# EAGLE design Smart_Plant (EAGLE 9.5.1)

## Sheet 1 of 2
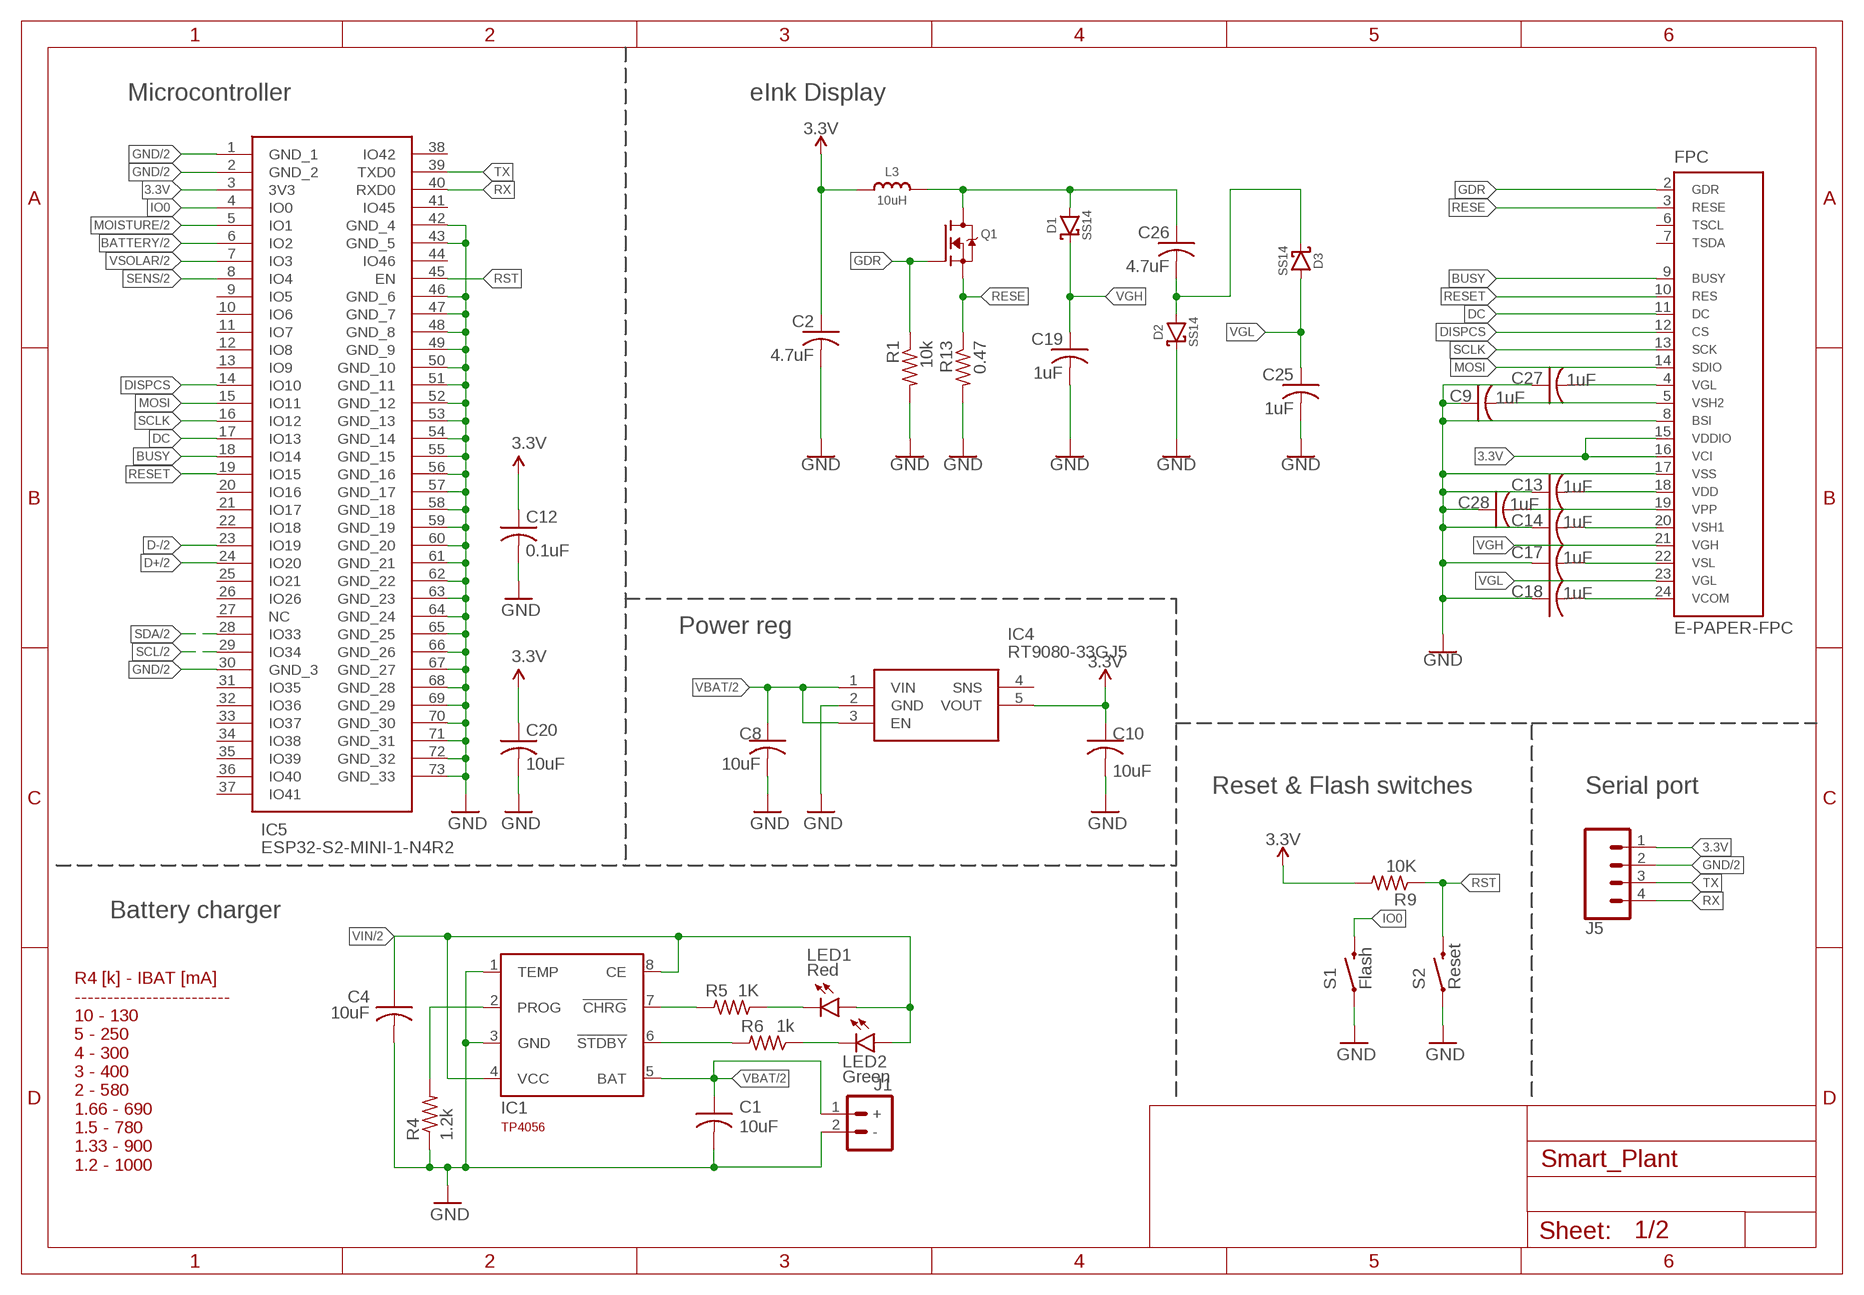
[diagram p0: schematic, sheet 1]

### Parts
C1  10uF  C-USC0603  [C0603]
C2  4.7uF  C-USC0603  [C0603]
C4  10uF  C-USC0603  [C0603]
C8  10uF  C-USC0603  [C0603]
C9  1uF  C-USC0603  [C0603]
C10  10uF  C-USC0603  [C0603]
C12  0.1uF  C-USC0603  [C0603]
C13  1uF  C-USC0603  [C0603]
C14  1uF  C-USC0603  [C0603]
C17  1uF  C-USC0603  [C0603]
C18  1uF  C-USC0603  [C0603]
C19  1uF  C-USC0603  [C0603]
C20  10uF  C-USC0603  [C0603]
C25  1uF  C-USC0603  [C0603]
C26  4.7uF  C-USC0603  [C0603]
C27  1uF  C-USC0603  [C0603]
C28  1uF  C-USC0603  [C0603]
D1  SS14  DIODE-SCHOTTKYSS14  [SMA-DIODE]
D2  SS14  DIODE-SCHOTTKYSS14  [SMA-DIODE]
D3  SS14  DIODE-SCHOTTKYSS14  [SMA-DIODE]
FPC  E-PAPER-FPC  [FPC_24_0.5MM]
IC1  TP4056  [SOT23-8]
IC4  RT9080-33GJ5  [SOT94P280X100-5N]
IC5  ESP32-S2-MINI-1-N4R2  [ESP32S2MINI1N4R2]
J1  BAT_CONN-JST-2MM-SMT  [JST-2-SMD]
J5  CONN_04PTH  [1X04]
L3  10uH  INDUCTORNR401  [INDUCTOR_4X4MM_NR401]
LED1  Red  LED0603  [LED_0603]
LED2  Green  LED0603  [LED_0603]
Q1  IRLML0100  IRLML2060TRPBF  [SOT23-3]
R1  10k  R-US_R0603  [R0603]
R4  1.2k  R-US_R0603  [R0603]
R5  1K  R-US_R0603  [R0603]
R6  1k  R-US_R0603  [R0603]
R9  10K  R-US_R0603  [R0603]
R13  0.47  R-US_R0603  [R0603]
S1  Flash  MOMENTARY-SWITCH-SPST-SMD-5.2MM-TALL  [TACTILE_SWITCH_SMD_5.2MM]
S2  Reset  MOMENTARY-SWITCH-SPST-SMD-5.2MM-TALL  [TACTILE_SWITCH_SMD_5.2MM]

### Nets
3.3V: C2.1 C10.1 C12.1 C20.1 FPC.15 FPC.16 IC4.5(VOUT) IC5.3(3V3) J5.1 L3.P$2 R9.2 ; also sheet 2
BATTERY: IC5.6(IO2) ; also sheet 2
BUSY: FPC.9 IC5.18(IO14)
D+: IC5.24(IO20) ; also sheet 2
D-: IC5.23(IO19) ; also sheet 2
DC: FPC.11 IC5.17(IO13)
DISPCS: FPC.12 IC5.14(IO10)
GDR: FPC.2 Q1.1(G) R1.1
GND: C1.2 C2.2 C4.2 C8.2 C9.1 C10.2 C12.2 C13.1 C14.1 C17.1 C18.1 C19.2 C20.2 C25.2 C27.1 C28.1 D2.C FPC.8 FPC.17 IC1.1(TEMP) IC1.3(GND) IC4.2(GND) IC5.1(GND_1) IC5.2(GND_2) IC5.30(GND_3) IC5.42(GND_4) IC5.43(GND_5) IC5.46(GND_6) IC5.47(GND_7) IC5.48(GND_8) IC5.49(GND_9) IC5.50(GND_10) IC5.51(GND_11) IC5.52(GND_12) IC5.53(GND_13) IC5.54(GND_14) IC5.55(GND_15) IC5.56(GND_16) IC5.57(GND_17) IC5.58(GND_18) IC5.59(GND_19) IC5.60(GND_20) IC5.61(GND_21) IC5.62(GND_22) IC5.63(GND_23) IC5.64(GND_24) IC5.65(GND_25) IC5.66(GND_26) IC5.67(GND_27) IC5.68(GND_28) IC5.69(GND_29) IC5.70(GND_30) IC5.71(GND_31) IC5.72(GND_32) IC5.73(GND_33) J1.2(-) J5.2 R1.2 R4.1 R13.2 S1.1 S2.1 ; also sheet 2
IO0: IC5.4(IO0) S1.3
MOISTURE: IC5.5(IO1) ; also sheet 2
MOSI: FPC.14 IC5.15(IO11)
N$1: IC1.6(!STDBY) R6.2
N$2: LED1.C R5.1
N$3: LED2.C R6.1
N$4: IC1.2(PROG) R4.2
N$6: IC1.7(!CHRG) R5.2
N$11: C9.2 FPC.5
N$12: C13.2 FPC.18
N$13: C14.2 FPC.20
N$14: C17.2 FPC.22
N$15: C18.2 FPC.24
N$16: C26.2 D2.A D3.C
N$17: C26.1 D1.A L3.P$1 Q1.3(D)
N$31: C27.2 FPC.4
N$32: C28.2 FPC.19
RESE: FPC.3 Q1.2(S) R13.1
RESET: FPC.10 IC5.19(IO15)
RST: IC5.45(EN) R9.1 S2.3
RX: IC5.40(RXD0) J5.4
SCL: IC5.29(IO34) ; also sheet 2
SCLK: FPC.13 IC5.16(IO12)
SDA: IC5.28(IO33) ; also sheet 2
SENS: IC5.8(IO4) ; also sheet 2
TX: IC5.39(TXD0) J5.3
VBAT: C1.1 C8.1 IC1.5(BAT) IC4.1(VIN) IC4.3(EN) J1.1(+) ; also sheet 2
VGH: C19.1 D1.C FPC.21
VGL: C25.1 D3.A FPC.23
VIN: C4.1 IC1.4(VCC) IC1.8(CE) LED1.A LED2.A ; also sheet 2
VSOLAR: IC5.7(IO3) ; also sheet 2
Unconnected: FPC.6 FPC.7 IC4.4(SNS) IC5.9(IO5) IC5.10(IO6) IC5.11(IO7) IC5.12(IO8) IC5.13(IO9) IC5.20(IO16) IC5.21(IO17) IC5.22(IO18) IC5.25(IO21) IC5.26(IO26) IC5.27(NC) IC5.31(IO35) IC5.32(IO36) IC5.33(IO37) IC5.34(IO38) IC5.35(IO39) IC5.36(IO40) IC5.37(IO41) IC5.38(IO42) IC5.41(IO45) IC5.44(IO46)

### Notes on the sheet
- Microcontroller | eInk Display
- Power reg
- Reset & Flash switches | Serial port
- Battery charger
- R4 [k] - IBAT [mA]
  ------------------------
  10 - 130
  5 - 250
  4 - 300
  3 - 400
  2 - 580
  1.66 - 690
  1.5 - 780
  1.33 - 900
  1.2 - 1000

## Sheet 2 of 2
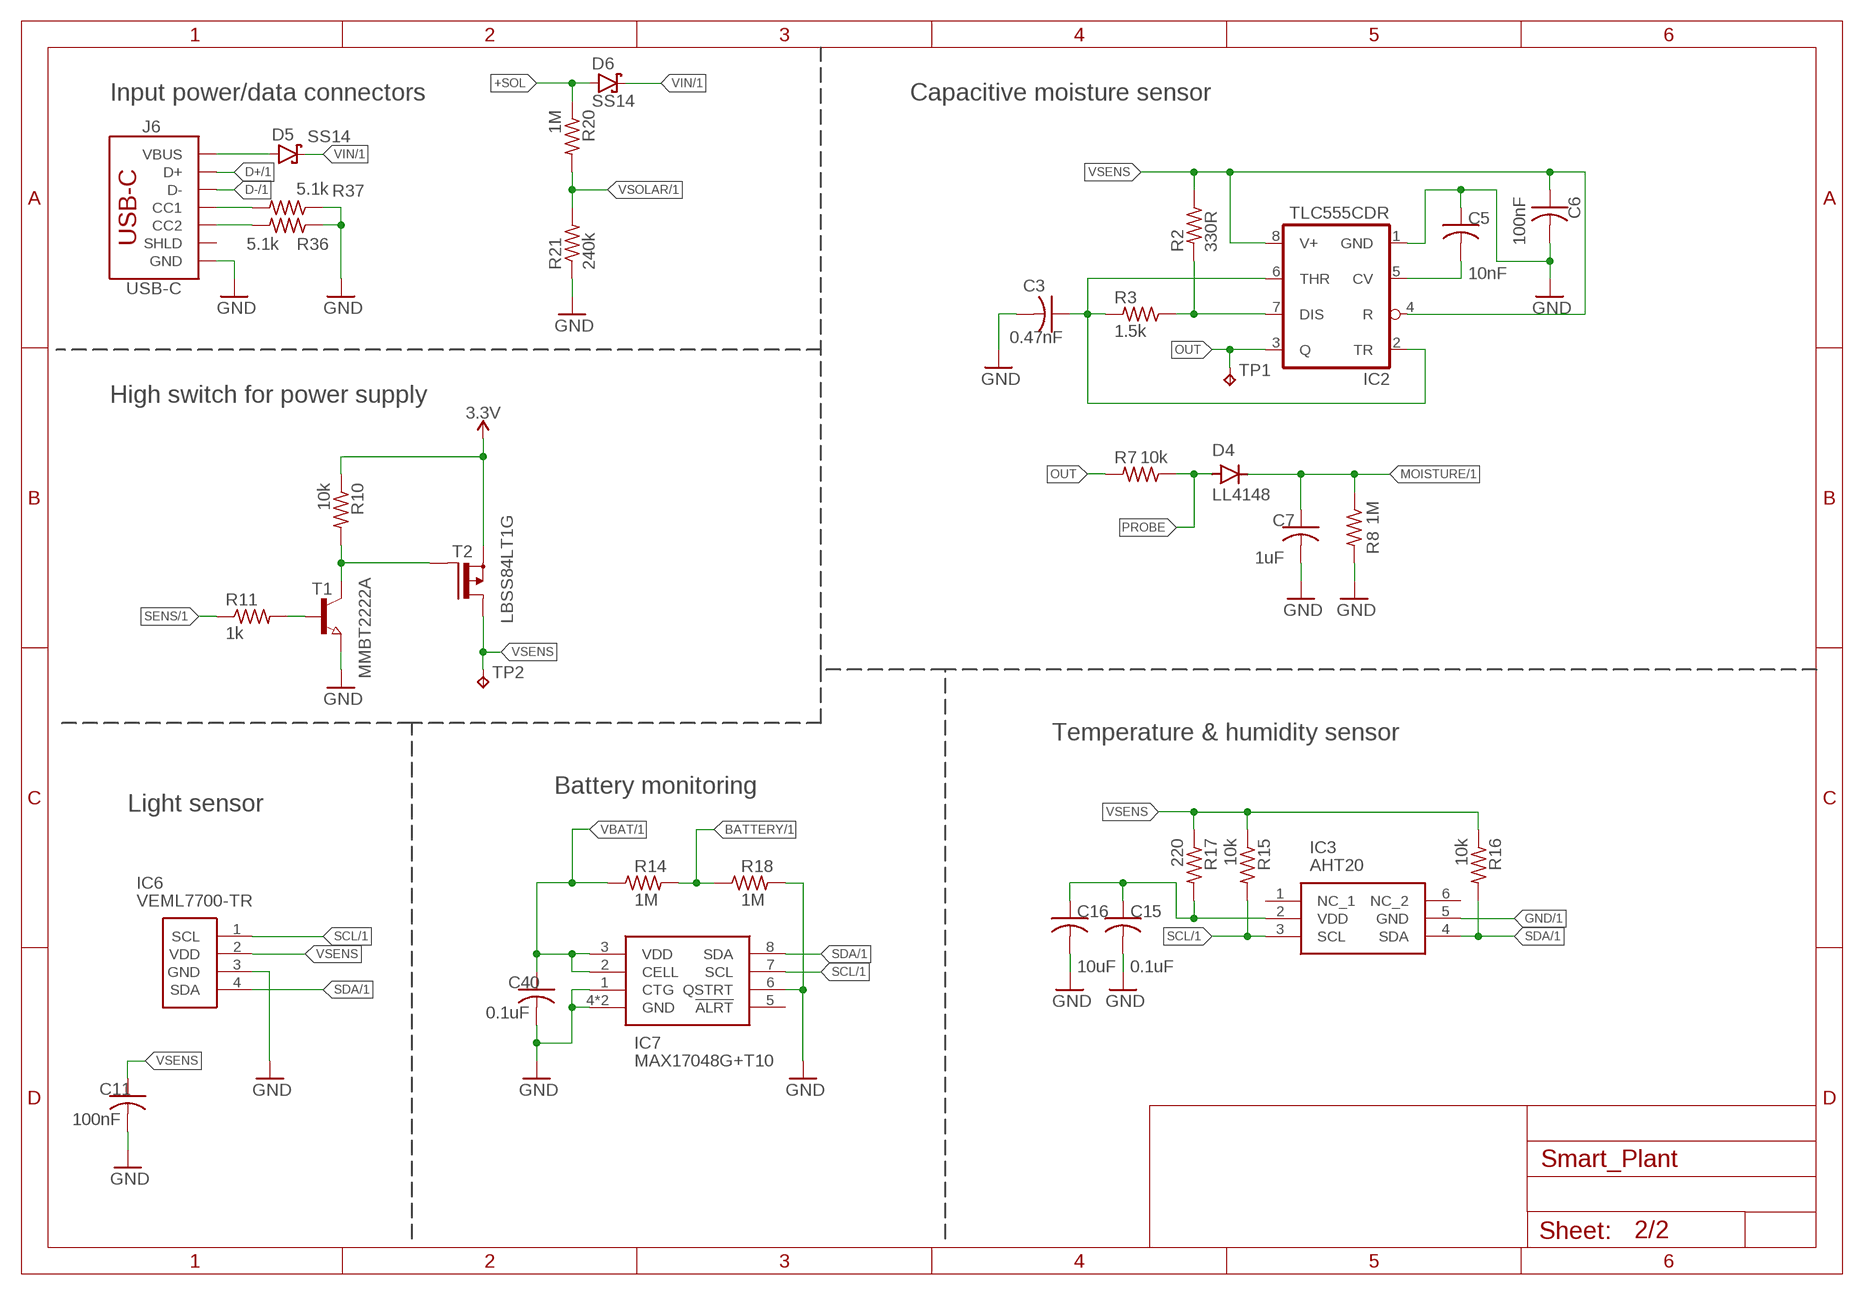
[diagram p1: schematic, sheet 2]

### Parts
C3  0.47nF  C-USC0603  [C0603]
C5  10nF  C-USC0603  [C0603]
C6  100nF  C-USC0603  [C0603]
C7  1uF  C-USC0603  [C0603]
C11  100nF  C-USC0603  [C0603]
C15  0.1uF  C-USC0603  [C0603]
C16  10uF  C-USC0603  [C0603]
C40  0.1uF  C-USC0603  [C0603]
D4  LL4148  [LL-34]
D5  SS14  DIODE-SCHOTTKYSS14  [SMA-DIODE]
D6  SS14  DIODE-SCHOTTKYSS14  [SMA-DIODE]
IC2  TLC555CDR  NE555D  [SO08]
IC3  AHT20  [AHT20]
IC6  VEML7700-TR  LIGHT_SENSOR-TR  [VEML7700-TR]
IC7  MAX17048G+T10  [SON50P200X200X80-9N]
J6  USB-C  USB_C_4-LAYER-ISOLATED  [USB-C-16P-4LAYER-ISOLATED]
R2  330R  R-US_R0603  [R0603]
R3  1.5k  R-US_R0603  [R0603]
R7  10k  R-US_R0603  [R0603]
R8  1M  R-US_R0603  [R0603]
R10  10k  R-US_R0603  [R0603]
R11  1k  R-US_R0603  [R0603]
R14  1M  R-US_R0603  [R0603]
R15  10k  R-US_R0603  [R0603]
R16  10k  R-US_R0603  [R0603]
R17  220  R-US_R0603  [R0603]
R18  1M  R-US_R0603  [R0603]
R20  1M  R-US_R0603  [R0603]
R21  240k  R-US_R0603  [R0603]
R36  5.1k  R-US_R0603  [R0603]
R37  5.1k  R-US_R0603  [R0603]
T1  MMBT2222A  T_NPN_MMBT2222A-1P_CHANGJ_SOT23-BEC  [SOT23]
T2  LBSS84LT1G  T_P-MOSFET_LBSS84LT1G_LRC_SOT23-GSD  [SOT23]
TP1  TPB1,27  [B1,27]
TP2  TPB1,27  [B1,27]

### Nets
3.3V: R10.1 T2.2(S) ; also sheet 1
+SOL [power]: D6.A R20.1
BATTERY: R14.2 R18.1 ; also sheet 1
D+: J6.A6(D+) J6.B6(D+) ; also sheet 1
D-: J6.A7(D-) J6.B7(D-) ; also sheet 1
GND: C3.2 C5.1 C6.2 C7.2 C11.2 C15.2 C16.2 C40.2 IC2.1(GND) IC3.5(GND) IC6.3(GND) IC7.1(CTG) IC7.4(GND) IC7.6(QSTRT) IC7.9(GND) J6.GND J6.GND2(GND) R8.2 R18.2 R21.1 R36.1 R37.1 T1.2(E) ; also sheet 1
MOISTURE: C7.1 D4.C R8.1 ; also sheet 1
N$5: C3.1 IC2.2(TR) IC2.6(THR) R3.2
N$7: IC2.7(DIS) R2.2 R3.1
N$8: C5.2 IC2.5(CV)
N$9: R10.2 T1.3(C) T2.1(G)
N$10: C15.1 C16.1 IC3.2(VDD) R17.2
N$18: R11.2 T1.1(B)
N$35: J6.B5(CC2) R36.2
N$46: J6.A5(CC1) R37.2
OUT: IC2.3(Q) R7.2 TP1.TP
PROBE: D4.A R7.1
SCL: IC3.3(SCL) IC6.1(SCL) IC7.7(SCL) R15.2 ; also sheet 1
SDA: IC3.4(SDA) IC6.4(SDA) IC7.8(SDA) R16.2 ; also sheet 1
SENS: R11.1 ; also sheet 1
V_USB: D5.A J6.VBUS1(VBUS) J6.VBUS2(VBUS)
VBAT: C40.1 IC7.2(CELL) IC7.3(VDD) R14.1 ; also sheet 1
VIN: D5.C D6.C ; also sheet 1
VSENS: C6.1 C11.1 IC2.4(R) IC2.8(V+) IC6.2(VDD) R2.1 R15.1 R16.1 R17.1 T2.3(D) TP2.TP
VSOLAR: R20.2 R21.2 ; also sheet 1
Unconnected: IC3.1(NC_1) IC3.6(NC_2) IC7.5(!ALRT) J6.SHLD1(SHLD) J6.SHLD2(SHLD) J6.SHLD3(SHLD) J6.SHLD4(SHLD) J6.SHLD5(SHLD) J6.SHLD6(SHLD) J6.SHLD7(SHLD) J6.SHLD8(SHLD)

### Notes on the sheet
- Input power/data connectors | Capacitive moisture sensor
- High switch for power supply
- Temperature & humidity sensor
- Battery monitoring
- Light sensor

## Library data of the parts
C1-C20 C25-C28 C40 = rcl:C-US: CAPACITOR, American symbol; SPICEPREFIX: C
D1-D3 D5 D6 = SpaceDIY_semiconductors:DIODE-SCHOTTKY: Schottky diode A Schottky diode is a semiconductor diode which has a low forward voltage drop and a very fast switching action.; PROD_ID: DIO-08053; VALUE: 1A/40V/500mV
D4 = SpaceDIY_semiconductors:LL4148: Diode Ultra Fast 100V 0.2A 2SOD-80 Source: Datasheet <https://www.onsemi.com/pub/Collateral/LL4148-D.pdf>; ARROW_PART_NUMBER: LL4148; ARROW_PRICE-STOCK: https://www.arrow.com/en/products/ll4148/on-semiconductor?region=europe; DESCRIPTION: Diode Ultra Fast 100V 0.2A 2SOD-80; HEIGHT: 1mm; LCSC: C9808; MANUFACTURER_NAME: onsemi; MANUFACTURER_PART_NUMBER: LL4148; MOUSER_PART_NUMBER: 512-LL4148; MOUSER_PRICE-STOCK: https://www.mouser.co.uk/ProductDetail/ON-Semiconductor-Fairchild/LL4148?qs=z%2Fr5wmDnQfY5jXgsdLPkRg%3D%3D
FPC = SpaceDIY_connectors:E-PAPER-FPC; LCSC: C2856831
IC1 = TP4056:TP4056: TP4056 Data sheet <http://goo.gl/J7k8TF> Dave.Calaway Eagle Library <https://goo.gl/Muy1Tr>; LCSC: C16581
IC2 = linear:*555: TIMER
IC3 = SamacSys_Parts:AHT20: Adafruit AHT20 - Temperature & Humidity Sensor Breakout Board - STEMMA QT / Qwiic Source: Datasheet <https://cdn-learn.adafruit.com/assets/assets/000/091/676/original/AHT20-datasheet-2020-4-16.pdf?1591047915>; DESCRIPTION: Adafruit AHT20 - Temperature & Humidity Sensor Breakout Board - STEMMA QT / Qwiic; HEIGHT: 1.1mm; MANUFACTURER_NAME: Adafruit; MANUFACTURER_PART_NUMBER: AHT20
IC4 = SamacSys_Parts:RT9080-33GJ5: IC REG LIN 3.3V 600MA TSOT23-5 Source: Datasheet <https://www.richtek.com/assets/product_file/RT9080/DS9080-05.pdf>; DESCRIPTION: IC REG LIN 3.3V 600MA TSOT23-5; HEIGHT: 1mm; LCSC: C841192; MANUFACTURER_NAME: RICHTEK; MANUFACTURER_PART_NUMBER: RT9080-33GJ5
IC5 = SpaceDIY_modules:ESP32-S2-MINI-1-N4R2: WiFi Modules - 802.11 SMD module, ESP32-S2FN4R2 with 4 MB flash die and 2 MB PSRAM die inside, PCB antenna Source: Datasheet <https://cz.mouser.com/datasheet/2/891/esp32_s2_mini_1_esp32_s2_mini_1u_datasheet_en-1928084.pdf>; DESCRIPTION: WiFi Modules - 802.11 SMD module, ESP32-S2FN4R2 with 4 MB flash die and 2 MB PSRAM die inside, PCB antenna; HEIGHT: 2.55mm; MANUFACTURER_NAME: Espressif Systems; MANUFACTURER_PART_NUMBER: ESP32-S2-MINI-1-N4R2; MOUSER_PART_NUMBER: 356-ESP32S2MINI1N4R2; MOUSER_PRICE-STOCK: https://www.mouser.co.uk/ProductDetail/Espressif-Systems/ESP32-S2-MINI-1-N4R2?qs=iLbezkQI%252Bsgb61FCBnw%252B9A%3D%3D
IC6 = SpaceDIY_sensors:LIGHT_SENSOR: High Accuracy Ambient Light Sensor with I2C Interface Source: Datasheet <http://www.vishay.com/docs/84286/veml7700.pdf>
IC7 = SpaceDIY_IC:MAX17048G+T10: Battery Management Host-Side Modelgauge (1-Cell) Source: Datasheet <https://datasheets.maximintegrated.com/en/ds/MAX17048-MAX17049.pdf>; LCSC: C2682616
J1 = SpaceDIY_connectors:BAT_CONN: Multi connection point. Often used as Generic Header-pin footprint for 0.1 inch spaced/style header connections On any of the 0.1 inch spaced packages, you can populate with these: Break Away Headers - Straight <https://www.sparkfun.com/products/116> (PRT-00116) Break Away Male Headers - Right Angle <https://www.sparkfun.com/products/553> (PRT-00553) Female Headers <https://www.sparkfun.com/products/115> (PRT-00115) Break Away Headers - Machine Pin <https://www.sparkfun.com/products/117> (PRT-00117) Break Away Female Headers - Swiss Machine Pin <https://www.sparkfun.com/products/743> (PRT-00743) For SCREWTERMINALS and SPRING TERMINALS visit here: Screw Terimnals on SparkFun.com <https://www.sparkfun.com/search/results?term=Screw+Terminals> (5mm/3.5mm/2.54mm spacing) This device is also useful as a general connection point to wire up your design to another part of your project. Our various solder wires solder well into these plated through hole pads. Hook-Up Wire - Assortment (Stranded, 22 AWG) <https://www.sparkfun.com/products/11375> (PRT-11375) Hook-Up Wire - Assortment (Solid Core, 22 AWG) <https://www.sparkfun.com/products/11367> (PRT-11367) View the entire wire category on our website here <https://www.sparkfun.com/categories/141> Special notes: Molex polarized connector foot print use with: PRT-08233 with associated crimp pins and housings. 2.54_SCREWTERM for use with PRT-10571. 3.5mm Screw Terminal footprints for PRT-08084 5mm Screw Terminal footprints for use with PRT-08432; LCSC: C3029440
J5 = SparkFun-Connectors:CONN_04: Multi connection point. Often used as Generic Header-pin footprint for 0.1 inch spaced/style header connections On any of the 0.1 inch spaced packages, you can populate with these: Break Away Headers - Straight <https://www.sparkfun.com/products/116> (PRT-00116) Break Away Male Headers - Right Angle <https://www.sparkfun.com/products/553> (PRT-00553) Female Headers <https://www.sparkfun.com/products/115> (PRT-00115) Break Away Headers - Machine Pin <https://www.sparkfun.com/products/117> (PRT-00117) Break Away Female Headers - Swiss Machine Pin <https://www.sparkfun.com/products/743> (PRT-00743) For SCREWTERMINALS and SPRING TERMINALS visit here: Screw Terimnals on SparkFun.com <https://www.sparkfun.com/search/results?term=Screw+Terminals> (5mm/3.5mm/2.54mm spacing) This device is also useful as a general connection point to wire up your design to another part of your project. Our various solder wires solder well into these plated through hole pads. Hook-Up Wire - Assortment (Stranded, 22 AWG) <https://www.sparkfun.com/products/11375> (PRT-11375) Hook-Up Wire - Assortment (Solid Core, 22 AWG) <https://www.sparkfun.com/products/11367> (PRT-11367) View the entire wire category on our website here <https://www.sparkfun.com/categories/141> Special notes: Molex polarized connector foot print use with SKU : PRT-08231 with associated crimp pins and housings. 1MM SMD Version SKU: PRT-10208; PROD_ID: CONN-09696
J6 = SparkFun-Connectors:USB_C: USB Type C 16Pin Connector Super Speed pins not available on the 16-pin purely SMD connector so this part is best for USB 2.0 implementations. D1 and D2 are tied together enabling D+/- no matter which way the cable is plugged into the connector. The two channel configuration pins (CC1/2) are exposed. These are normally connected to ground via 5.1k resistors but can be reconfigured for high current/high power applications. **4-LAYER BOARD WARNING!!** If designing 4-layer board, make sure to select the variant _4-LAYER-ISOLATED. The linked footprint (USB-C-16-4LAYER-ISOLATED) includes some very necessary cutout polygons in the inner layers (2 and 15). This prevents the PTH mounting shield legs on the USB connector from electrically connecting any other polygons on the inner layers (usually VCC and GND).; LCSC: C2765186; PROD_ID: CONN-14122; VALUE: USB Female Type C Connector
L3 = microbuilder:INDUCTOR: Inductors 0603: 10nH Ceramic Inductor - microwire antenna/RF (Digikey: 712-1434-2-ND) 0805: 560nH Ceramic Inductor - RF (Digikey: 553-1047-1-ND) 270nH Ceramic Inductor - Q = 40@250MHz, +-5%, 1 Ohm DC Resistance (Digikey: 535-10506-2-ND) 1007 (2518 Metric) SMT: 10µH 10% 250mOhm 820mA 1007 Inductor (Digikey: 587-2189-1-ND) 22µH 10% 500mOhm 580mA 1007 Inductor (Digikey: 587-2190-1-ND) 47µH 10% 950mOhm 420mA 1007 Inductor (Digikey: 587-2191-1-ND) 47µH 5% 100mOhm 1A 1008 Inductor (Digikey: 732-1816-1-ND) 5.0x5.0mm (Taiyo Yuden NR5040 Series) 6.8µH 20% 2.3A 64mOhm Inductor (Digikey: 587-2374-2-ND) 5.0x5.0mm (TDK VLC5045 Series) 4.7µH 20% 3.3A 34mOhm Inductor (Digikey: 445-6526-1-ND) 6.8µH 20% 2.7A 46mOhm Inductor (Digikey: 445-6527-1-ND) 6.0x6.0mm (TDK VLC6045 Series) 4.7µH 20% 3.8A 27mOhm Inductor (Digikey: 445-6538-2-ND) 6.8µH 20% 3A 41mOhm Inductor (Digikey: 445-6540-1-ND) 6.2µH 30% 2.2A 45mOhm Inductor (Digikey: SRR5028-6R2YCT-ND) - Not TDK VLC6045 but footprint should match 6.0x6.0mm (TDK SLF6045 Series) 6.8uH 30% 2A 33mOhm Inductor (Digikey: 445-4572-1-ND, Mouser: 810-SLF645T6R8N2R0PF) 6.0x6.0mm (Sumida CDRH5D28 Series) 6.2uH 30% 1.8A 45mOhm Inductor (Digikey: 308-1542-1-ND) Taiyo Yuden NR3015T2R2M - 2.2uH 20% 1.5A (Digikey: 587-1648-2-ND, Mouser: 963-NR3015T2R2M) - Used with TI TPS62172 CoilCraft RFID Transponder Coil - MA5532-AE (For use with AS3935 Lightning Sensor) Taiyo Yuden NRH2412T2R2MNGH - 2.2uH 20% 1AA (Digikey: 587-3443-1-ND) - Used with TI LM3671 Vishay IHLP 1.0uH Molded Inductor - 24mOhm DCR, 5A, +/-20%, -55°C-125°C (Digikey: 541-1319-1-ND)
LED1 = SpaceDIY_semiconductors:LED: LED (Generic) Standard schematic elements and footprints for 5mm, 3mm, 0402, 0603 , 0805 and 1206 sized LEDs. Generic LEDs with no color specified.; LCSC: C2286
LED2 = SpaceDIY_semiconductors:LED: LED (Generic) Standard schematic elements and footprints for 5mm, 3mm, 0402, 0603 , 0805 and 1206 sized LEDs. Generic LEDs with no color specified.; LCSC: C72043
Q1 = Parts:IRLML2060TRPBF
R1-R11 R13-R18 R20 R21 R36 R37 = rcl:R-US_: RESISTOR, American symbol; SPICEPREFIX: R
S1 S2 = SpaceDIY_electromechanical:MOMENTARY-SWITCH-SPST: Momentary Switch (Pushbutton) - SPST Normally-open (NO) SPST momentary switches (buttons, pushbuttons). Variants PTH-12MM - 12mm square, through-hole Momentary Pushbutton Switch - 12mm Square <https://www.sparkfun.com/products/9190> (COM-09190) PTH-6.0MM, PTH-6.0MM-KIT - 6.0mm square, through-hole Mini Pushbutton Switch <https://www.sparkfun.com/products/97> (COM-00097) KIT package intended for soldering kit's - only one side of pads' copper is exposed. PTH-RIGHT-ANGLE-KIT - Right-angle, through-hole Right Angle Tactile Button <https://www.sparkfun.com/products/10791> - Used on SparkFun BigTime Watch Kit <https://www.sparkfun.com/products/11734> SMD-12MM - 12mm square, surface-mount Tactile Button - SMD (12mm) <https://www.sparkfun.com/products/12993> (COM-12993) Used on SparkFun PicoBoard <https://www.sparkfun.com/products/11888> SMD-4.5MM - 4.5mm Square Trackball Switch Used on SparkFun Blackberry Trackballer Breakout <https://www.sparkfun.com/products/13169> SMD-4.6MMX2.8MM - 4.60mm x 2.80mm, surface mount Used on SparkFun Pro Micro - RP2040 <https://www.sparkfun.com/products/17717> SMD-5.2MM, SMD-5.2-REDUNDANT - 5.2mm square, surface-mount Mini Pushbutton Switch - SMD <https://www.sparkfun.com/products/8720> (COM-08720) Used on Arduino Pro Mini <https://www.sparkfun.com/products/11114> REDUNDANT package connects both switch circuits together SMD-6.0X3.5MM - 6.0 x 3.5mm, surface mount Momentary Reset Switch SMD <https://www.sparkfun.com/products/8229> (COM-08229) SMD-6.2MM-TALL - 6.2mm square, surface mount Tactile Button - SMD (6mm) <https://www.sparkfun.com/products/12992> Used on SparkFun Digital Sandbox <https://www.sparkfun.com/products/12651> SMD-RIGHT-ANGLE - Right-angle, surface mount Used on SparkFun Block for Intel® Edison - Arduino <https://www.sparkfun.com/products/13036>; LCSC: C318884; PROD_ID: SWCH-14139
T1 = JLC PCB Basic Parts_loc:T_NPN_: Transistor NPN; LCSC_DATASHEET: https://datasheet.lcsc.com/lcsc/1811081957_Changjiang-Electronics-Tech--CJ-MMBT2222A-1P_C8512.pdf; LCSC_PART: C8512; LCSC_PRICE1_EUR: 0.023149606; LCSC_ROTATION_CCW: 180; PROPERTIES: 0.3W NPN 0.6A 40V SOT-23(SOT-23-3) Bipolar Transistors - BJT ROHS
T2 = JLC PCB Basic Parts_loc:T_P-MOSFET_: Transistor P-MOSFET; LCSC_DATASHEET: https://datasheet.lcsc.com/lcsc/1811031711_LRC-LBSS84LT1G_C8492.pdf; LCSC_PART: C8492; LCSC_PRICE1_EUR: 0.031496063; LCSC_ROTATION_CCW: 180; PROPERTIES: 2V 250uA 10Ohm 100mA,5V 0.13A 0.225W P Channel 50V SOT-23(SOT-23-3) MOSFETs ROHS
TP1 TP2 = testpad:TP: Test pad

## Net classes
1 power: width 0.254 mm

## Board
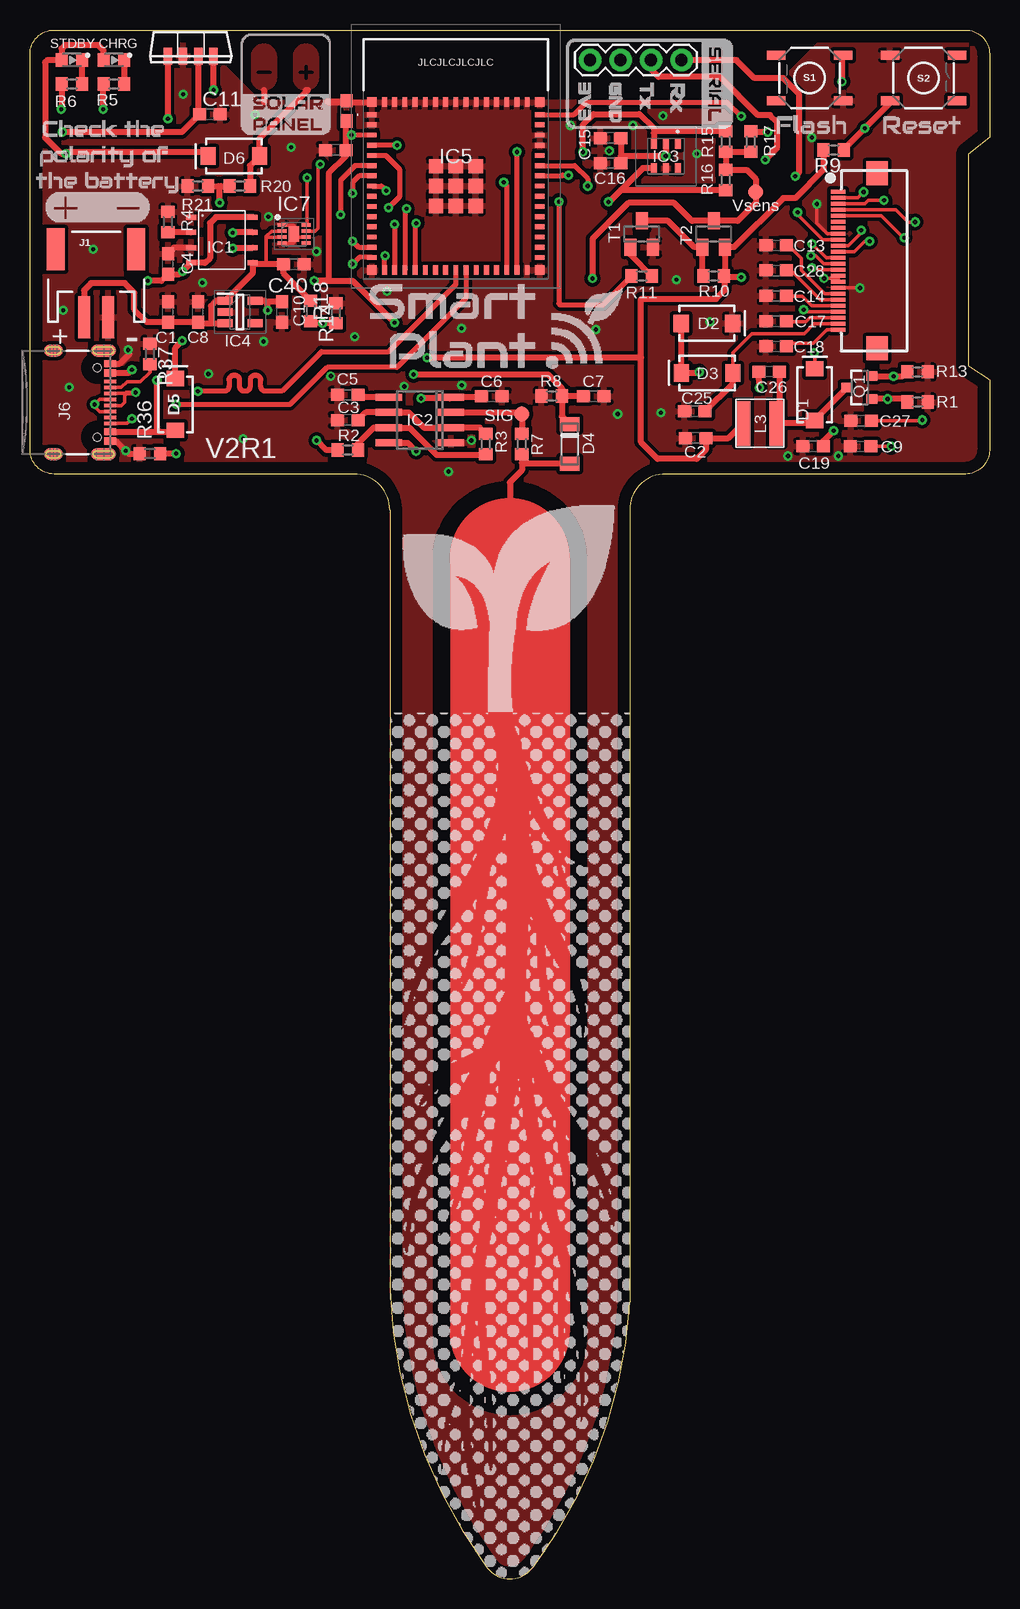
[diagram p2: board, top side]
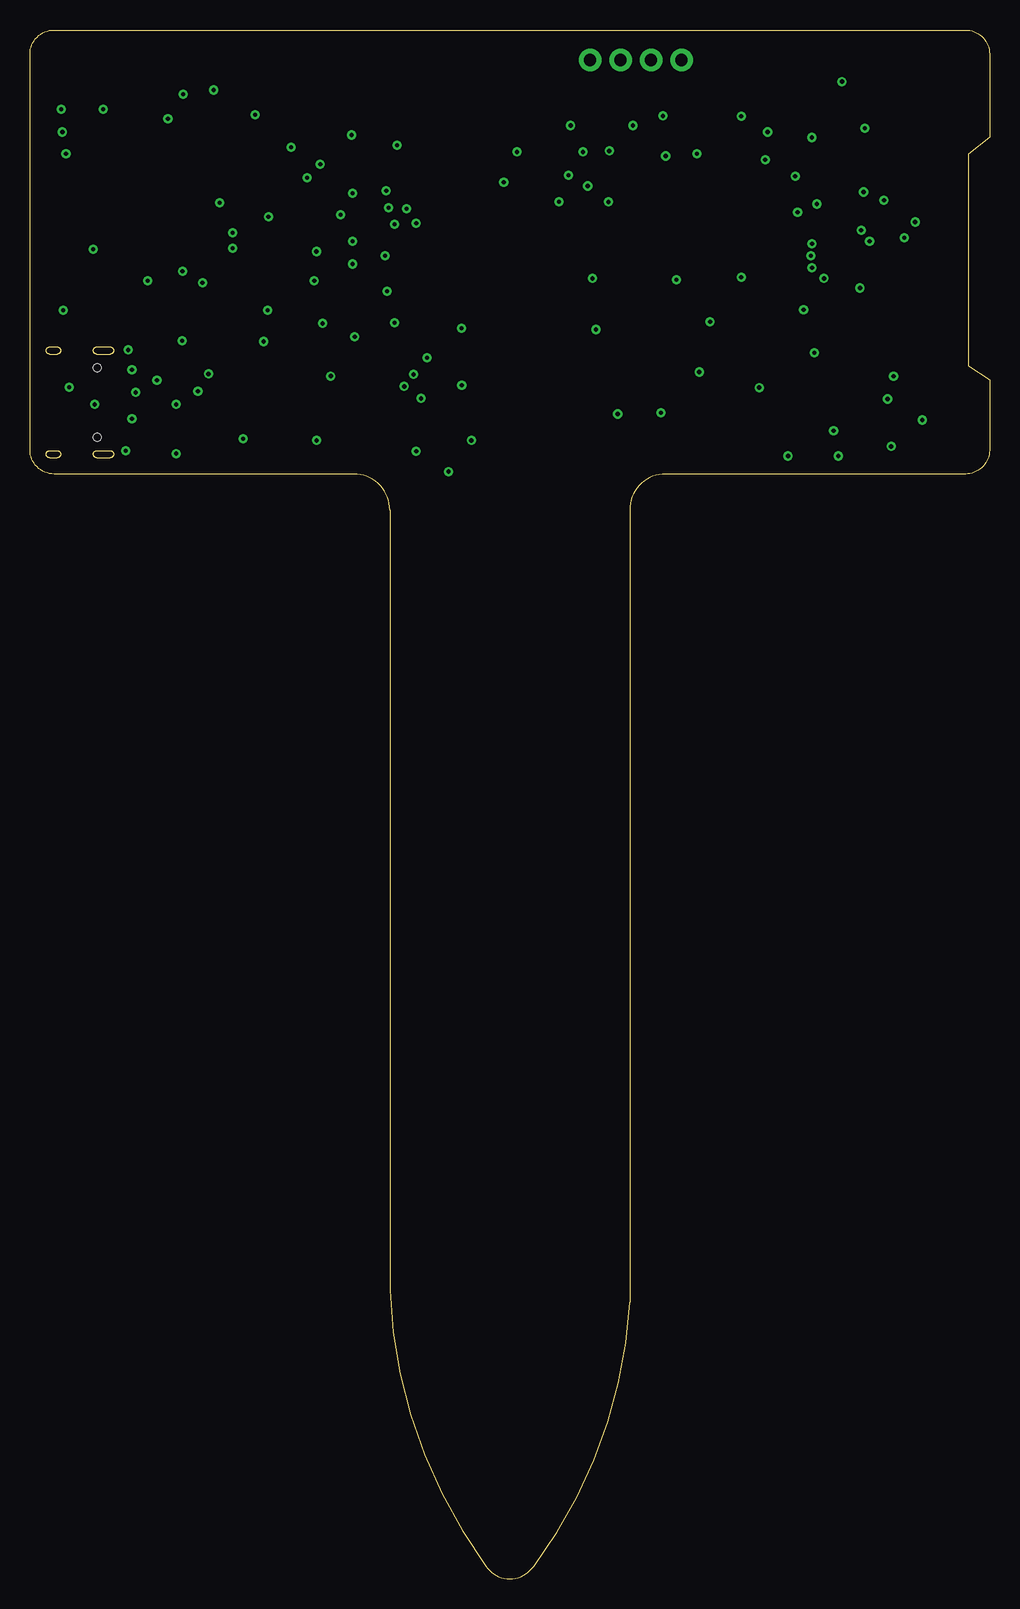
[diagram p3: board, inner layer Route2]
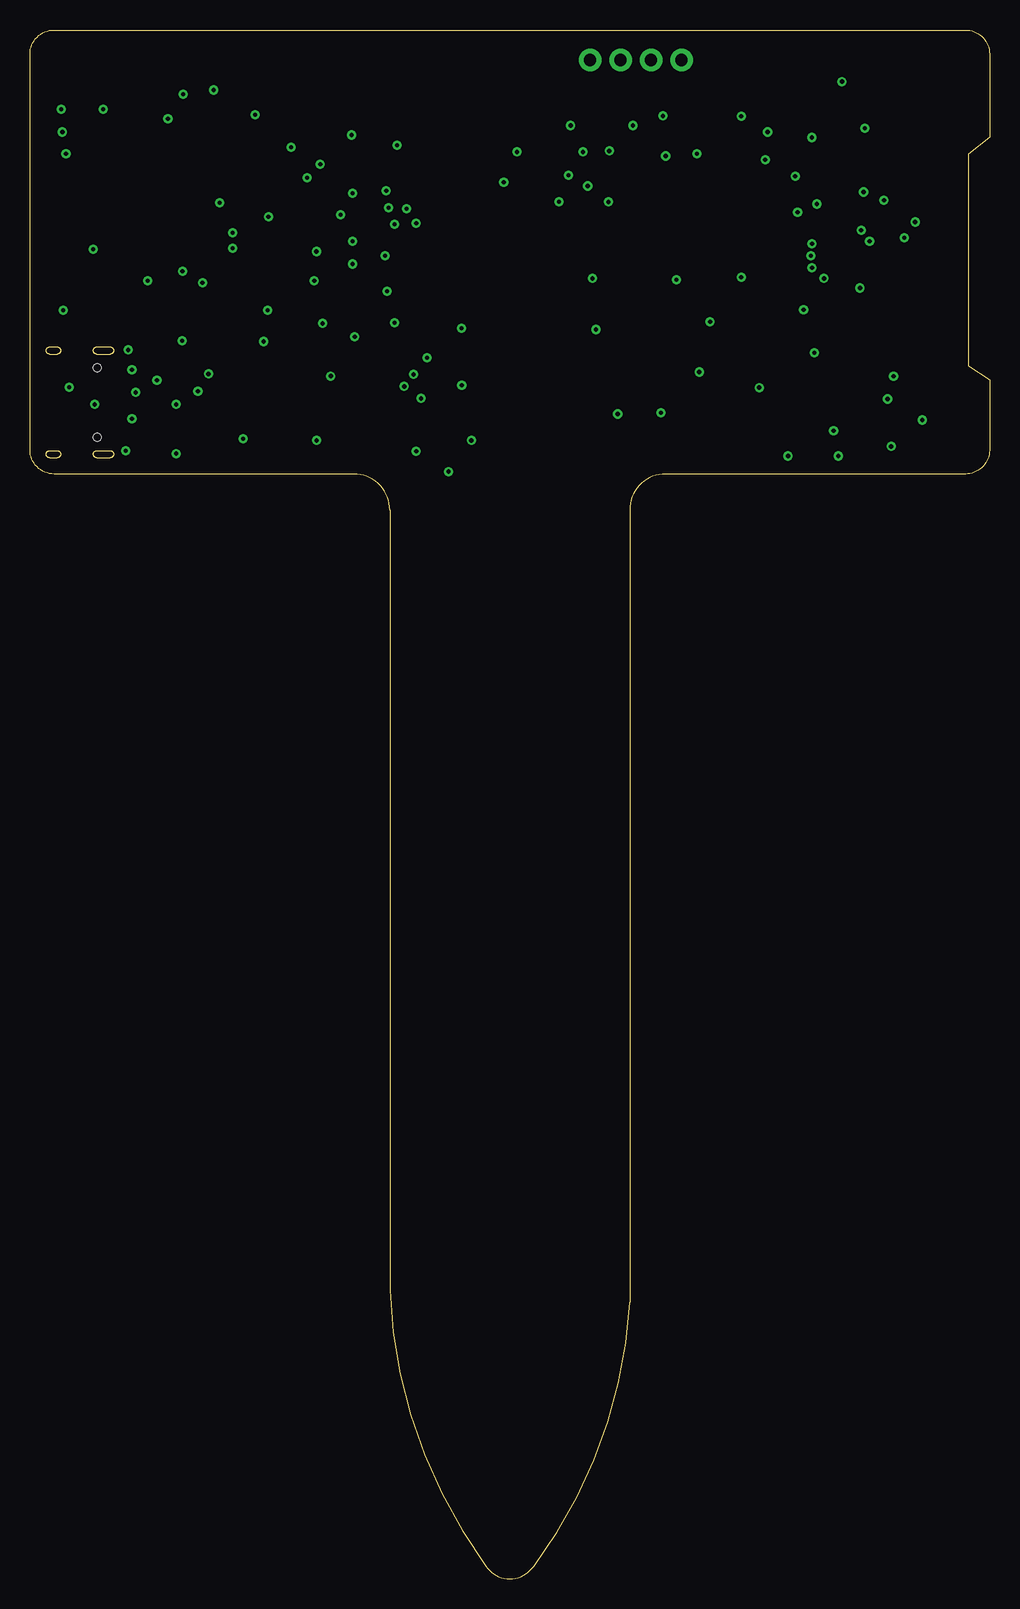
[diagram p4: board, inner layer Route15]
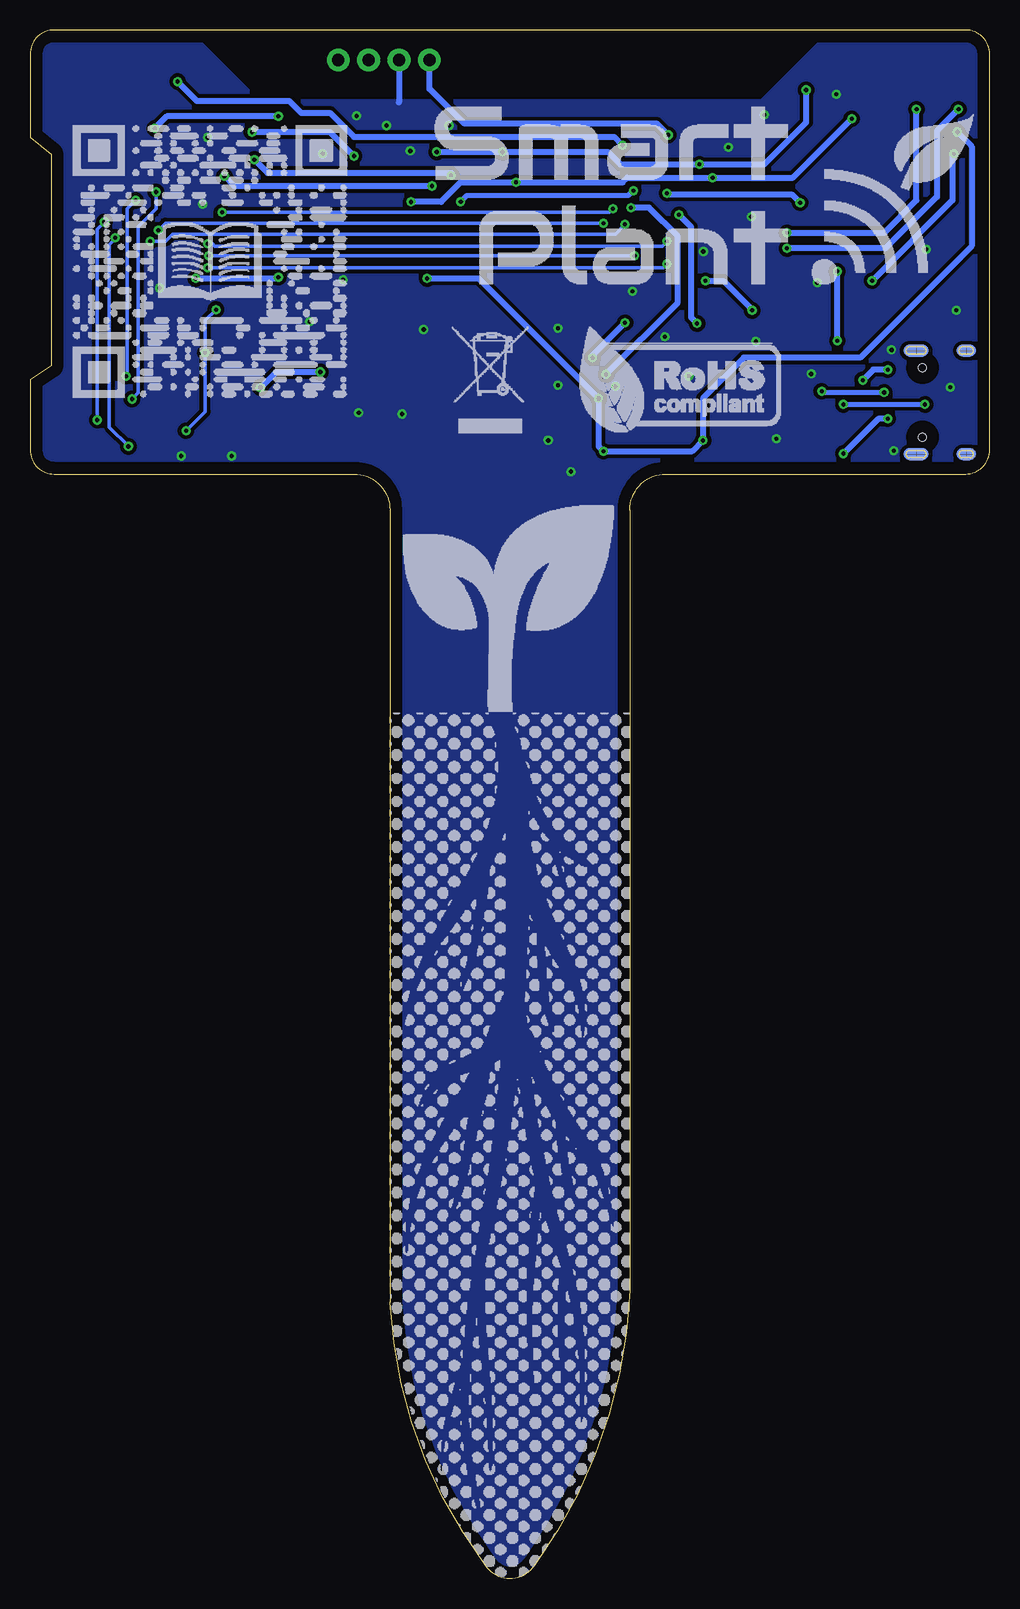
[diagram p5: board, bottom side, seen from below]

Size 80.01 x 129.07 mm. Coordinates in mm from the lower left corner, seen from the top.
Outline: 78,129.07 arc-90 80,127.07 80.01,120.12 78.23,118.73 78.23,101.07 80.01,99.93 80,94.07 arc-90 78,92.07 53,92.07 arc90 50,89.07 50,23.07 arc-34 42,1.07 arc-112 38,1.07 arc-34 30,24.07 30,89.06 arc90 26.99,92.07 2,92.07 arc-90 0,94.07 0,127.07 arc-90 2,129.07 78,129.07
Copper layers (1*16): Top 0.035mm / dielectric 1.5mm / Bottom 0.035mm
Design rules "default": minimum track width 6mil, minimum drill 0.35mm, track to track 6mil, track to pad 6mil, pad to pad 6mil, via to via 6mil, smd to smd 6mil, copper to edge 40mil, drill to drill 6mil, minimum pad ring 10mil, minimum via ring 8mil, stop-mask expansion 4mil, vias tented up to drill 0mil, thermal gap 10mil
tRestrict: 9 lines

### Footprints (pad centres in the part's own frame; a part is rotated, then mirrored left to right if it is on the bottom)
C0603 = smd 1.1 x 1: 1 -0.85,0; 2 0.85,0
SMA-DIODE = smd 1.27 x 1.47: A -2.15,0; C 2.15,0
LL-34 = smd 1.15 x 1.65: A 1.65,0; C -1.65,0
FPC_24_0.5MM = smd 0.3 x 1.2: 1 5.75,3.25; 2 5.25,3.25; 3 4.75,3.25; 4 4.25,3.25; 5 3.75,3.25; 6 3.25,3.25; 7 2.75,3.25; 8 2.25,3.25; 9 1.75,3.25; 10 1.25,3.25; 11 0.75,3.25; 12 0.25,3.25; 13 -0.25,3.25; 14 -0.75,3.25; 15 -1.25,3.25; 16 -1.75,3.25; 17 -2.25,3.25; 18 -2.75,3.25; 19 -3.25,3.25; 20 -3.75,3.25; 21 -4.25,3.25; 22 -4.75,3.25; 23 -5.25,3.25; 24 -5.75,3.25 | smd 2 x 1.8: P$25 -7.3,0; P$26 7.3,0
SOT23-8 = smd 0.42 x 0.835: 1 -1.905,-2.58; 2 -0.635,-2.58; 3 0.635,-2.58; 4 1.905,-2.58; 5 1.905,2.58; 6 0.635,2.58; 7 -0.635,2.58; 8 -1.905,2.58
SO08 = smd 0.6 x 2.2: 1 -1.905,-2.6; 2 -0.635,-2.6; 3 0.635,-2.6; 4 1.905,-2.6; 5 1.905,2.6; 6 0.635,2.6; 7 -0.635,2.6; 8 -1.905,2.6
AHT20 = smd 0.8 x 0.5: 1 -1,1; 2 -1,0; 3 -1,-1; 4 1,-1; 5 1,0; 6 1,1
SOT94P280X100-5N = smd 1.25 x 0.65: 1 -1.25,0.94; 2 -1.25,0; 3 -1.25,-0.94; 4 1.25,-0.94; 5 1.25,0.94
ESP32S2MINI1N4R2 = smd 0.8 x 0.4: 1 -7,5.95; 2 -7,5.1; 3 -7,4.25; 4 -7,3.4; 5 -7,2.55; 6 -7,1.7; 7 -7,0.85; 8 -7,0; 9 -7,-0.85; 10 -7,-1.7; 11 -7,-2.55; 12 -7,-3.4; 13 -7,-4.25; 14 -7,-5.1; 15 -7,-5.95; 31 7,-5.95; 32 7,-5.1; 33 7,-4.25; 34 7,-3.4; 35 7,-2.55; 36 7,-1.7; 37 7,-0.85; 38 7,0; 39 7,0.85; 40 7,1.7; 41 7,2.55; 42 7,3.4; 43 7,4.25; 44 7,5.1; 45 7,5.95 | smd 0.4 x 0.8: 16 -5.95,-7; 17 -5.1,-7; 18 -4.25,-7; 19 -3.4,-7; 20 -2.55,-7; 21 -1.7,-7; 22 -0.85,-7; 23 0,-7; 24 0.85,-7; 25 1.7,-7; 26 2.55,-7; 27 3.4,-7; 28 4.25,-7; 29 5.1,-7; 30 5.95,-7; 46 5.95,7; 47 5.1,7; 48 4.25,7; 49 3.4,7; 50 2.55,7; 51 1.7,7; 52 0.85,7; 53 0,7; 54 -0.85,7; 55 -1.7,7; 56 -2.55,7; 57 -3.4,7; 58 -4.25,7; 59 -5.1,7; 60 -5.95,7 | smd 1.2 x 1.2: 61 0,0; 66 -1.65,1.65; 67 -1.65,0; 68 -1.65,-1.65; 69 0,-1.65; 70 1.65,-1.65; 71 1.65,0; 72 1.65,1.65; 73 0,1.65 | smd 0.8 x 0.8: 62 -7,7; 63 -7,-7; 64 7,-7; 65 7,7
VEML7700-TR = smd 0.711 x 1.422: 1 5.305,0.3; 2 4.035,0.3; 3 2.765,0.3; 4 1.495,0.3
SON50P200X200X80-9N = smd 0.75 x 0.3: 1 -1,0.75; 2 -1,0.25; 3 -1,-0.25; 4 -1,-0.75; 5 1,-0.75; 6 1,-0.25; 7 1,0.25; 8 1,0.75 | smd 0.9 x 1.3: 9 0,0
JST-2-SMD = smd 1 x 3.5: 1 1,3.95; 2 -1,3.95 | smd 1.5 x 3.5: NC1 3.35,-1.75; NC2 -3.35,-1.75
1X04 = drill 1.016 pad 1.88: 1 0,0; 2 2.54,0; 3 5.08,0; 4 7.62,0
USB-C-16P-4LAYER-ISOLATED = smd 0.3 x 1: A5 -1.25,-0.34; A6 -0.25,-0.34; A7 0.25,-0.34; A8 1.25,-0.34; B5 1.75,-0.34; B6 0.75,-0.34; B7 -0.75,-0.34; B8 -1.75,-0.34 | smd 0.6 x 1: GND -3.225,-0.34; GND2 3.225,-0.34; VBUS1 -2.45,-0.34; VBUS2 2.45,-0.34 | smd 1 x 2.1: SHLD1 -4.32,-0.915; SHLD2 4.32,-0.915 | smd 1 x 2.1 bottom: SHLD3 -4.32,-0.915; SHLD4 4.32,-0.915 | smd 1 x 1.6: SHLD5 -4.32,-5.095; SHLD8 4.32,-5.095 | smd 1 x 1.6 bottom: SHLD6 -4.32,-5.095; SHLD7 4.32,-5.095 | hole 0.65: -2.89,-1.445; 2.89,-1.445
INDUCTOR_4X4MM_NR401 = smd 1.2 x 3.7: P$1 -1.4,0; P$2 1.4,0
LED_0603 = smd 1 x 1.1: A -0.86,0; C 0.84,0
SOT23-3 = smd 0.8 x 0.9: 1 -0.95,-1; 2 0.95,-1; 3 0,1.1
R0603 = smd 1 x 1.1: 1 -0.85,0; 2 0.85,0
TACTILE_SWITCH_SMD_5.2MM = smd 1.524 x 0.762: 1 -2.794,1.905; 2 2.794,1.905; 3 -2.794,-1.905; 4 2.794,-1.905
SOT23 = smd 1.4 x 1: 1 -1.1,0.95; 2 -1.1,-0.95; 3 1.1,0
B1,27 = smd 1.27 x 1.27: TP 0,0

### Placement (x,y rotation side)
C1  11.5,105.57 90 top
C2  55.5,95.07 180 top
C3  26.5,96.57 180 top
C4  11.5,109.57 90 top
C5  26.5,98.67 0 top
C6  38.5,98.57 0 top
C7  47,98.57 0 top
C8  14,105.57 90 top
C9  69.25,94.37 0 top
C10  21,105.57 270 top
C11  15,122.07 0 top
C12  26.38,122.33 90 top
C13  62.22,111.13 0 top
C14  62.22,106.92 0 top
C15  48.4,120.07 180 top
C16  48.4,117.97 180 top
C17  62.22,104.82 0 top
C18  62.22,102.71 0 top
C19  65.29,94.36 180 top
C20  25.5,119.07 180 top
C25  55.43,97.28 180 top
C26  61.63,100.59 180 top
C27  69.29,96.52 0 top
C28  62.22,109.03 0 top
C40  22,109.57 0 top
D1  65.42,98.68 90 top
D2  56.43,104.62 0 top
D3  56.45,100.49 180 top
D4  45,94.57 270 top
D5  12.12,97.87 90 top
D6  17,118.57 180 top
FPC  70.64,109.84 90 top
IC1  16,111.57 270 top
IC2  32.5,96.57 90 top
IC3  53,118.57 270 top
IC4  17.5,105.57 0 top
IC5  35.5,116.07 0 top
IC6  10,126.57 0 top
IC7  22,112.07 0 top
J1  5.5,109.07 180 top
J5  46.7,126.57 0 top
J6  7.04,98.04 270 top
L3  60.86,96.28 180 top
LED1  7,126.57 0 top
LED2  3.5,126.57 0 top
Q1  69.19,99.27 90 top
R1  74,98.07 0 top
R2  26.5,94.07 0 top
R3  38,94.57 90 top
R4  11.5,113.07 270 top
R5  7,124.57 180 top
R6  3.5,124.57 180 top
R7  41,94.57 90 top
R8  43.5,98.57 180 top
R9  67,119.07 180 top
R10  57,108.57 180 top
R11  51,108.57 0 top
R13  74,100.58 0 top
R14  23.4,105.67 270 top
R15  58,119.77 90 top
R16  58,116.57 270 top
R17  60.1,119.77 90 top
R18  25.5,105.47 90 top
R20  17.5,116.07 180 top
R21  14,116.07 0 top
R36  10,93.77 0 top
R37  10,102.07 270 top
S1  65,125.07 180 top
S2  74.5,125.07 0 top
T1  51,112.07 90 top
T2  57,112.07 90 top
TP1  41,97.07 90 top
TP2  60.5,115.57 90 top

### Tracks (layer width: path | path; a pad name or v marks a point on that pad's centre or on a via)
3.3V  (via drill 0.35)
  Top 0.305: FPC.16 FPC.15 67.17,108.37 v66.2,108.37
  Top 0.406: IC5.3 v26.8,120.32 26.4,120.32 26.35,120.37
  Top 0.508: v59.3,108.47 57.95,108.47 | 57.95,108.47 R10.1 | 57.95,108.47 T2.2 58.7,110.97 62.8,115.07 63.8,115.07 66.15,117.42 R9.2 | L3.P$2 58.25,95.07 C2.1 56.35,94.09 55.6,93.34 52.33,93.34 50.95,94.72 50.95,101.77 | 57.95,108.47 57.95,107.42 57.2,106.67 50.95,106.67 50.95,101.77 | 50.95,101.77 v33.1,101.77 | C12.1 26.35,120.37 C20.1 26.35,118.57 24.9,117.12 24.9,108.17 v23.7,108.17 26.9,108.17 v30.4,104.67 | IC4.5 19.55,106.51 19.8,106.26 v19.8,105.71 19.8,106.42 C10.1
  Bottom 0.508: v66.2,108.37 59.4,108.37 v59.3,108.47 | v26.8,120.32 27.75,121.27 43.8,121.27 46.7,124.17 J5.1 | v23.7,108.17 22.2,108.17 19.8,105.77 v19.8,105.71 | v30.4,104.67 33.1,101.97 v33.1,101.77
  pour Route15: -56.73,107.98 -50.25,107.98 -50.25,103.35 -41.49,103.35 -41.49,123.67 -56.73,123.67
+SOL
  Top 0.508: R20.1 18.35,117.77 D6.A 19.15,120.07 23.15,124.07 23,124.07
  pour Top (no thermals): 22,126.87 arc-90 23,127.87 arc-90 24,126.87 24,125.07 arc-90 23,124.07 arc-90 22,125.07
BATTERY  (via drill 0.35)
  Top 0.406: IC5.6 27.1,117.77 25.9,116.57 v25.9,113.67
  Top 0.508: R18.1 v24.4,104.62 23.6,104.62 R14.2
  Bottom 0.508: v25.9,113.67 24.9,112.67 24.9,105.12 v24.4,104.62
BUSY  (via drill 0.35)
  Top 0.305: v64,113.87 64,113.67 66.09,111.58 FPC.9
  Top 0.406: v31.4,114.17 31.25,114.02 IC5.18
  Bottom 0.305: v31.4,114.17 31.7,113.87 v64,113.87
D+  (via drill 0.35)
  Top 0.305: J6.A6 5.82,98.29 v5.4,97.87 5.4,97.67 5.8,97.27 6.68,97.27 J6.B6
  Top 0.406: IC5.24 36.35,106.72 30.59,100.96 24.78,100.96 21.68,97.87 v12.2,97.87
  Bottom 0.406: v12.2,97.87 v5.4,97.87
D-  (via drill 0.35)
  Top 0.305: J6.B7 7.98,98.79 7.9,98.71 7.9,98.07 7.6,97.77 6.72,97.77 J6.A7
  Top 0.406: v8.8,98.87 8.72,98.79 7.98,98.79 | v14,98.97 16.2,98.97 arc90 16.59,99.36 16.59,99.9 arc-90 16.99,100.29 17.08,100.29 arc-90 17.48,99.9 17.48,99.36 arc90 17.87,98.97 17.96,98.97 arc90 18.36,99.36 18.36,99.9 arc-90 18.75,100.29 18.84,100.29 arc-90 19.24,99.9 19.24,99.36 arc90 19.63,98.97 21,98.97 24.3,102.27 29.9,102.27 35.5,107.87 IC5.23
  Bottom 0.406: v14,98.97 13.9,98.87 v8.8,98.87
DC  (via drill 0.35)
  Top 0.305: v70,111.47 69.6,111.47 68.71,110.58 FPC.11
  Top 0.406: v30.4,112.87 IC5.17
  Bottom 0.305: v70,111.47 68.7,111.47 68.1,112.07 31.2,112.07 v30.4,112.87
DISPCS  (via drill 0.35)
  Top 0.305: v65.2,111.27 66.39,110.08 FPC.12
  Top 0.406: v26.9,111.47 27.4,110.97 IC5.14
  Bottom 0.305: v65.2,111.27 64.8,111.27 64.6,111.07 40.8,111.07 40.58,111.07 27.3,111.07 v26.9,111.47
GDR  (via drill 0.35)
  Top 0.305: v69.5,115.57 69.01,115.08 FPC.2
  Top 0.508: R1.1 72.9,98.32 v71.5,98.32 Q1.1
  Bottom 0.305: v69.5,115.57 69.5,114.17 71,112.67 71,98.82 v71.5,98.32
GND  (via drill 0.35)
  Top 0.305: FPC.17 69.18,107.59 v69.2,107.57 | FPC.8 66.48,112.09 65.6,112.97 v65.6,114.57 | IC7.6 22.25,111.82 IC7.9 | IC7.1 21.95,112.82 22,112.77 IC7.9 | IC7.4 21.95,111.32 22,111.37 IC7.9
  Top 0.508: J6.GND 7.5,101.26 8.28,102.05 | 19.5,124.07 19.5,123.07 | IC1.3 12.02,110.93 C4.2 | J6.GND2 7.17,94.81 v7.98,94.01 8.22,93.77 R36.1 | C12.2 26.31,123.11 24.8,123.11 24.84,123.07 IC5.62
  Bottom 0.508: J5.2 49.24,123.03
  other vias: 55.6,118.77 53.9,108.27 56.7,104.77 49,97.07 52.6,97.17 34.9,92.27 36,99.47 31.2,99.37 36.8,94.87 67.4,93.57 63.2,93.57 48.3,118.99 52.78,121.91 25.08,100.23 21.78,119.31 18.78,122.01 5.28,110.81 2.78,105.71 8.18,102.41 3.28,99.31 17.78,95.01 47.18,104.11 29.78,107.31 27.08,103.51 23.88,110.61 19.88,113.51 14.88,100.41 19.48,103.11 14.38,108.01 50.28,121.11 65.18,120.11 35.98,104.21 12.78,123.71 45.08,121.11
  pour Top (isolate 0.305): 2,92.07 arc-90 0,94.07 0,127.07 arc-90 2,129.07 13,129.07 19,123.07 61,123.07 67,129.07 78,129.07 arc-90 80,127.07 80.01,120.12 78.23,118.73 78.23,101.07 80.01,99.93 80,94.07 arc-90 78,92.07 53,92.07 arc90 50,89.07 50,23.07 arc-34 42,1.07 arc-112 38,1.07 arc-34 30,24.07 30,89.06 arc90 26.99,92.07
  pour Bottom (isolate 0.305): 2,92.07 arc-90 0,94.07 0,127.07 arc-90 2,129.07 13,129.07 19,123.07 61,123.07 67,129.07 78,129.07 arc-90 80,127.07 80.01,120.12 78.23,118.73 78.23,101.07 80.01,99.93 80,94.07 arc-90 78,92.07 53,92.07 arc90 50,89.07 50,23.07 arc-34 42,1.07 arc-112 38,1.07 arc-34 30,24.07 30,89.06 arc90 26.99,92.07
  pour Route2: -56.73,123.67 -41.49,123.67 -41.49,103.35 -50.25,103.35 -50.25,107.98 -56.73,107.98
  pour Top (no thermals): 18.5,126.87 arc-90 19.5,127.87 arc-90 20.5,126.87 20.5,125.07 arc-90 19.5,124.07 arc-90 18.5,125.07
IO0  (via drill 0.35)
  Top 0.406: v30.6,119.47 IC5.4
  Top 0.508: S1.3 67.7,126.88 v67.7,124.77
  Bottom 0.508: v67.7,124.77 66.1,123.17 58.4,123.17 57.4,122.17 55,122.17 53,120.17 31.3,120.17 v30.6,119.47
MOISTURE  (via drill 0.35)
  Top 0.406: IC5.5 29.65,118.62 30.8,117.47 30.8,115.17 v29.9,114.27
  Top 0.508: v31.98,100.37 43.2,100.37 44.35,99.22 R8.1 | D4.C 44.35,96.87 R8.1 | C7.1 R8.1
  Bottom 0.508: v31.98,100.37 26,106.35 26,111.87 28.4,114.27 v29.9,114.27
MOSI  (via drill 0.35)
  Top 0.305: v65.2,109.27 65.48,109.27 65.67,109.08 FPC.14
  Top 0.406: IC5.15 27.45,110.12 v26.9,109.57
  Bottom 0.305: v65.2,109.27 44.8,109.27 44.6,109.27 27.2,109.27 v26.9,109.57
N$1  (via drill 0.35)
  Top 0.508: R6.2 2.65,122.52 v2.6,122.47 | v16.9,110.87 16.96,110.93 IC1.6
  Bottom 0.508: v2.6,122.47 4.4,120.67 4.4,115.17 8.7,110.87 v16.9,110.87
N$2
  Top 0.508: LED1.C R5.1
N$3
  Top 0.508: R6.1 LED2.C
N$4
  Top 0.508: IC1.2 11.52,112.2 R4.2
N$5
  Top 0.508: C3.1 27.98,97.2 IC2.6 31.57,97.2 32.84,95.93 34.6,95.93 IC2.2 37.48,95.93 R3.2
N$6  (via drill 0.35)
  Top 0.508: IC1.7 16.93,112.2 v16.9,112.17 | v6.1,122.47 6.1,124.52 R5.2
  Bottom 0.508: v16.9,112.17 8.8,112.17 6.1,114.87 v6.1,122.47
N$7
  Top 0.508: R2.2 27.35,94.62 28.66,95.93 IC2.7 31.64,95.93 33.9,93.67 37.95,93.67 R3.1
N$8
  Top 0.508: IC2.5 27.55,98.47 C5.2
N$9
  Top 0.508: T1.3 53.2,113.17 55.4,110.97 T2.1 56.05,108.67 R10.2
N$10  (via drill 0.35)
  Top 0.508: C15.1 49.25,118.57 | 49.25,118.57 C16.1 | 49.25,118.57 v53,118.57 IC3.2 | v61.5,120.57 60.15,120.57 R17.2
  Bottom 0.508: v53,118.57 55,120.57 v61.5,120.57
N$11  (via drill 0.35)
  Top 0.305: v72.9,111.77 72.8,111.77 70.98,113.59 FPC.5 | v71.8,94.37 C9.2
  Bottom 0.305: v72.9,111.77 72.9,111.67 73.4,111.17 73.4,95.97 v71.8,94.37
N$12
  Top 0.305: C13.2 63.24,111.13 64.3,110.07 64.3,109.07 66.29,107.08 FPC.18
N$13
  Top 0.305: C14.2 63.13,106.87 64.4,106.87 65.19,106.08 FPC.20
N$14
  Top 0.305: FPC.22 65.02,105.09 64.7,104.77 63.12,104.77 C17.2
N$15
  Top 0.305: C18.2 63.33,102.97 65.3,102.97 66.42,104.09 FPC.24
N$16  (via drill 0.35)
  Top 0.508: D2.A 54.3,104.6 D3.C 55.72,100.49 v55.8,100.57 | v60.8,99.27 60.76,100.57 C26.2
  Bottom 0.508: v55.8,100.57 59.5,100.57 v60.8,99.27
N$17
  Top 0.508: Q1.3 65.42,96.6 D1.A 65.17,96.28 L3.P$1 62.48,96.5 C26.1
N$18
  Top 0.508: T1.1 50.05,110.37 R11.2
N$31  (via drill 0.35)
  Top 0.305: C27.2 74.35,96.52 v74.4,96.57 | v73.8,113.07 73.21,113.07 72.19,114.09 FPC.4
  Bottom 0.305: v74.4,96.57 74.4,112.47 v73.8,113.07
N$32
  Top 0.305: C28.2 63.44,109.03 65.89,106.58 FPC.19
N$35  (via drill 0.35)
  Top 0.305: J6.B5 8.12,96.29 v8.5,96.67
  Top 0.508: v12.2,93.77 R36.2
  Bottom 0.508: v8.5,96.67 9.3,96.67 v12.2,93.77
N$46
  Top 0.305: J6.A5 7.62,99.29 8.1,99.77 9.2,99.77 10,100.57 R37.2
OUT
  Top 0.508: IC2.3 40.87,97.2 TP1.TP R7.2
PROBE
  Top 0.508: R7.1 41,92.97 | 41,92.97 41,92.37 40,91.37 40,85.07 | D4.A 41.05,92.92 41,92.97
  Top 10: 40,85.07 40,20.57
RESE  (via drill 0.35)
  Top 0.305: v71.2,114.87 69.9,114.87 69.61,114.58 FPC.3
  Top 0.508: Q1.2 v72,100.22 72.79,100.22 R13.1
  Bottom 0.305: v71.2,114.87 71.9,114.17 71.9,100.32 v72,100.22
RESET  (via drill 0.35)
  Top 0.305: v69.3,112.37 69.3,112.17 68.21,111.08 68.2,111.09 FPC.10
  Top 0.406: v32.2,112.97 32.1,112.87 IC5.19
  Bottom 0.305: v69.3,112.37 68.7,112.97 v32.2,112.97
RST  (via drill 0.35)
  Top 0.406: IC5.45 45.35,122.02 46.4,123.07 58.1,123.07 v59.3,121.87
  Top 0.508: S2.3 71.71,122.97 v69.6,120.87 67.85,119.12 R9.1
  Bottom 0.508: v59.3,121.87 68.6,121.87 v69.6,120.87
RX  (via drill 0.35)
  Top 0.406: v46.5,116.07 46.5,116.67 45.4,117.77 IC5.40
  Top 0.508: v63.8,116.87 64.1,117.17 64.1,123.77 62.8,125.07 60.4,125.07 58.9,126.57 J5.4
  Bottom 0.508: v46.5,116.07 63,116.07 v63.8,116.87
SCL  (via drill 0.35)
  Top 0.305: IC7.7 23.75,112.32 24,112.57 24,117.67 v24.2,117.87
  Top 0.406: IC5.29 v40.6,118.91
  Top 0.508: R15.2 52.15,120.62 52,120.47 | 52,120.47 IC3.3 | v46.1,118.91 46.1,121.17 47,122.07 50.8,122.07 52,120.87 52,120.47 | v15.3,124.07 IC6.1
  Bottom 0.508: v15.3,124.07 15.3,121.37 18.8,117.87 v24.2,117.87 30.8,117.87 31.84,118.91 v40.6,118.91 v46.1,118.91
SCLK  (via drill 0.35)
  Top 0.305: v65.1,110.27 65.5,110.27 66.19,109.58 FPC.13
  Top 0.406: IC5.16 29.55,110.22 v29.6,110.27
  Bottom 0.305: v65.1,110.27 45.3,110.27 45.1,110.27 v29.6,110.27
SDA  (via drill 0.35)
  Top 0.305: IC7.8 23.1,112.92 v23.1,116.77
  Top 0.406: 48.25,114.72 v48.23,114.74 | IC5.28 39.75,116.12 v39.5,116.37
  Top 0.508: IC3.4 51.1,117.57 49.25,115.72 | 49.25,115.72 48.25,114.72 | R16.2 49.25,115.72 | IC6.4 v11.49,121.67 v11.5,121.67
  Bottom 0.508: v48.23,114.74 45.73,114.74 44.1,116.37 v39.5,116.37 30.6,116.37 30.2,116.77 v23.1,116.77 16.4,116.77 v11.5,121.67
SENS  (via drill 0.35)
  Top 0.406: R11.1 47.75,106.17 44.2,106.17 44.1,106.27 v44.1,114.77 | IC5.8 29.3,116.07 v29.7,115.67
  Bottom 0.406: v29.7,115.67 29.74,115.67 30.15,115.26 43.61,115.26 v44.1,114.77
TX  (via drill 0.35)
  Top 0.406: IC5.39 44.35,116.92 44.4,116.97 v44.9,116.97
  Top 0.508: v61.3,118.27 62.3,119.27 62.3,121.37 61.7,121.97 60.7,121.97 57.5,125.17 52.4,125.17 51.7,125.87 51.7,126.49 J5.3
  Bottom 0.508: v61.3,118.27 60.2,117.17 44.9,117.17 v44.9,116.97
V_USB  (via drill 0.35)
  Top 0.508: J6.VBUS2 10.8,95.59 | 10.8,95.59 11.99,95.59 D5.A | J6.VBUS1 8.22,100.49 v8.5,100.77 | v10.58,99.88 10.58,95.8 10.8,95.59
  Bottom 0.508: v8.5,100.77 9.7,100.77 v10.58,99.88
VBAT
  Top 0.254: 19.75,111.82 19.7,111.77
  Top 0.305: IC7.2 20.15,112.32 19.7,111.87 19.7,111.77 19.7,109.57 | IC7.3 19.75,111.82
  Top 0.508: R14.1 21.15,108.77 C40.1 19.7,109.57 18.68,109.57 IC1.5 | IC1.5 | IC1.5 18.59,108.84 IC4.1 15.54,106.51 15.1,106.07 15.1,104.77 15.24,104.63 | 15.24,104.63 IC4.3 | 15.24,104.63 14.09,104.63 C8.1 C1.1 9.75,104.72 8.7,105.77 8.7,107.17 7.9,107.97 5.1,107.97 4.5,107.37 J1.1
VGH  (via drill 0.35)
  Top 0.305: v64.5,105.77 64.69,105.58 FPC.21 | v65.4,102.17 65.42,102.15 D1.C
  Top 0.508: C19.1 66.14,94.81 v67,95.67
  Bottom 0.305: v64.5,105.77 65.4,104.87 v65.4,102.17 65.4,97.27 v67,95.67
VGL
  Top 0.305: D3.A 58.6,102.17 60.2,103.77 64.56,103.77 65.37,104.58 FPC.23
  Top 0.508: C25.1 58.6,99.61 D3.A
VIN  (via drill 0.35)
  Top 0.508: IC1.8 15.51,113.47 15,112.97 15,110.07 14.6,109.66 IC1.4 v12.71,108.95 12.47,108.72 C4.1 10.95,108.17 v9.8,108.17 | D5.C 12.12,102.59 v12.7,103.17 | LED1.A 6.14,127.36 5.7,127.8 2.93,127.8 2.64,127.51 LED2.A 1.47,126.57 1.27,126.37 1.27,120.1 2.6,118.77 v3,118.77 3.1,118.87 14.55,118.87 D6.C
  Bottom 0.508: v12.7,103.17 12.7,108.94 v12.71,108.95 | v9.8,108.17 3.1,114.87 3.1,118.57 3,118.67 v3,118.77
VSENS  (via drill 0.35)
  Top 0.508: R2.1 24.7,94.07 v23.9,94.87 | IC2.8 31.5,94.66 v32.2,93.97 | C6.1 37.55,98.47 IC2.4 34.99,98.37 v32.6,98.37 | v46.9,108.37 46.9,111.67 49.9,114.67 53.7,114.67 55.2,113.17 T2.3 59,113.17 60.5,114.67 TP2.TP 60.5,116.67 59.75,117.42 R16.1 R15.1 R17.1 | v2.7,120.57 12.65,120.57 C11.1 14.04,122.18 IC6.2
  Bottom 0.508: v46.9,108.37 42.6,108.37 v32.6,98.37 32.6,94.37 v32.2,93.97 24.8,93.97 v23.9,94.87 23.9,98.37 20.5,101.77 10.8,101.77 1.5,111.07 1.5,119.37 v2.7,120.57
VSOLAR  (via drill 0.35)
  Top 0.406: IC5.7 27.45,116.92 26.9,116.37 v26.9,115.47
  Top 0.508: v15.8,114.67 15.8,115.97 | 15.8,115.97 15.9,116.07 R20.2 | R21.2 15.7,116.07 15.8,115.97
  Bottom 0.508: v26.9,115.47 26.8,115.37 16.5,115.37 v15.8,114.67

### Text on the board
tPlace: V2R1
tNames: STDBY | CHRG | JLCJLCJLCJLC | Vsens | SIG